# EAGLE design MODULO_LDR (EAGLE 7.5.0)
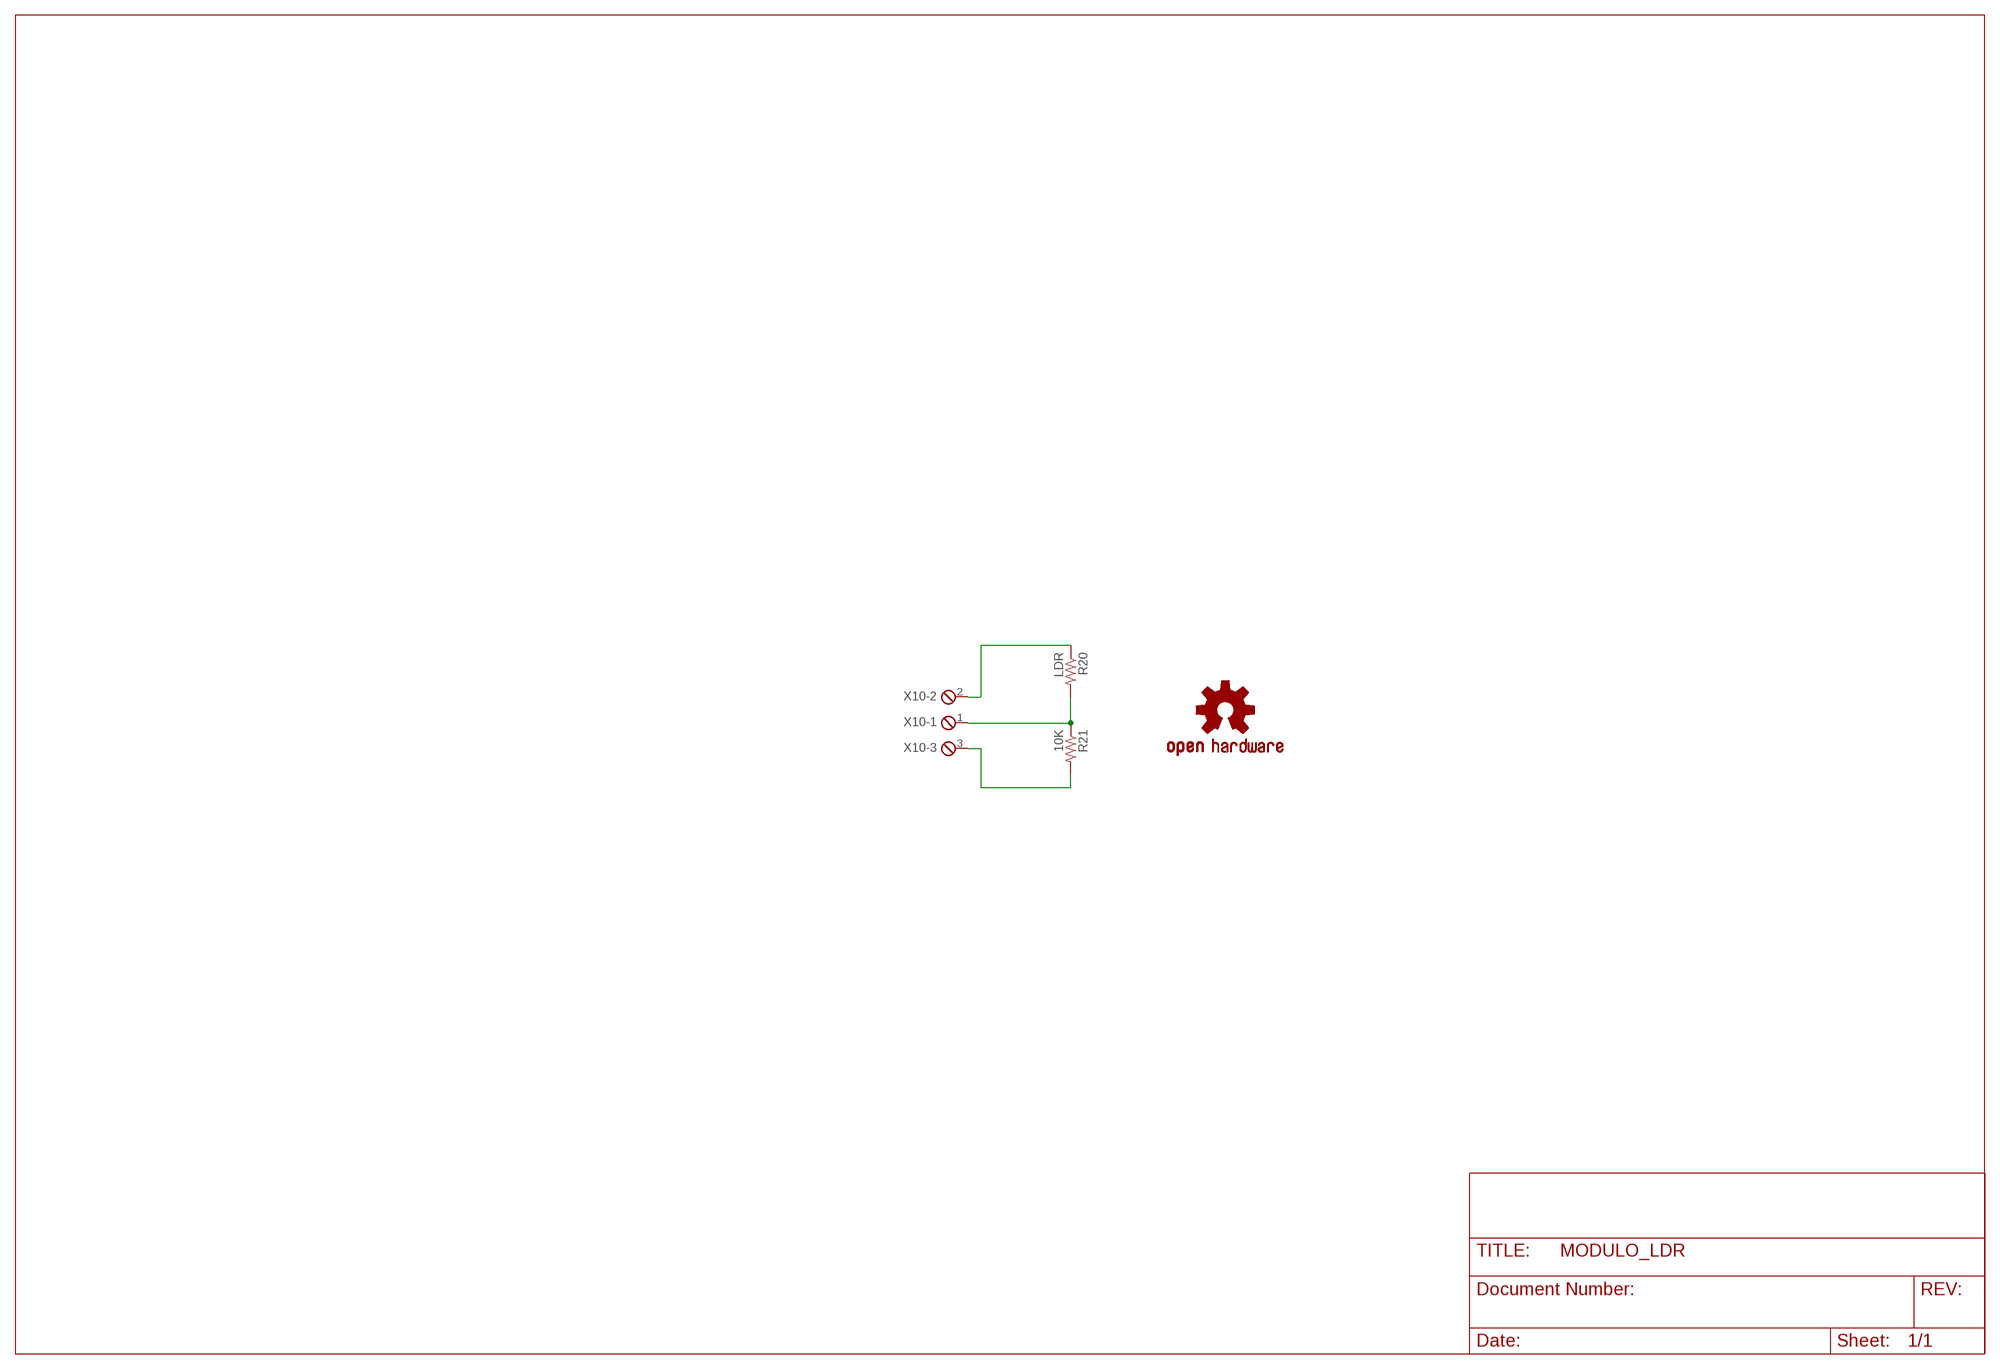
[diagram p0: schematic, sheet 1]

## Parts
LOGO1  OSHW-LOGOS  [OSHW-LOGO-S]
R20  LDR  RESISTORPTH-1/6W  [1/6W-RES]
R21  10K  RESISTORPTH-1/4W  [AXIAL-0.4]
X10  MPT3  [3POL254]

## Nets
N$51: R20.1 X10.2
N$52: R21.P$2 X10.3
N$53: R20.2 R21.P$1 X10.1

## Library data of the parts
LOGO1 = SparkFun-Aesthetics:OSHW-LOGO: Open Source Hardware Logo This logo indicates the piece of hardware it is found on incorporates a OSHW license and/or adheres to the definition of open source hardware found here: http://freedomdefined.org/OSHW
R20 R21 = SparkFun:RESISTOR: Resistor Basic schematic elements and footprints for 0603, 1206, and PTH resistors.
X10 = con-phoenix-254:MPT3: PHOENIX CONNECTOR; OC_FARNELL: unknown; OC_NEWARK: unknown

## Board
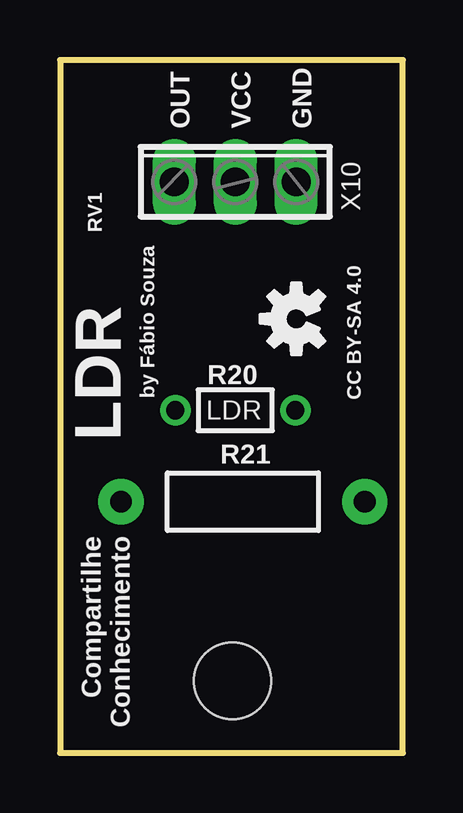
[diagram p1: board, top side]
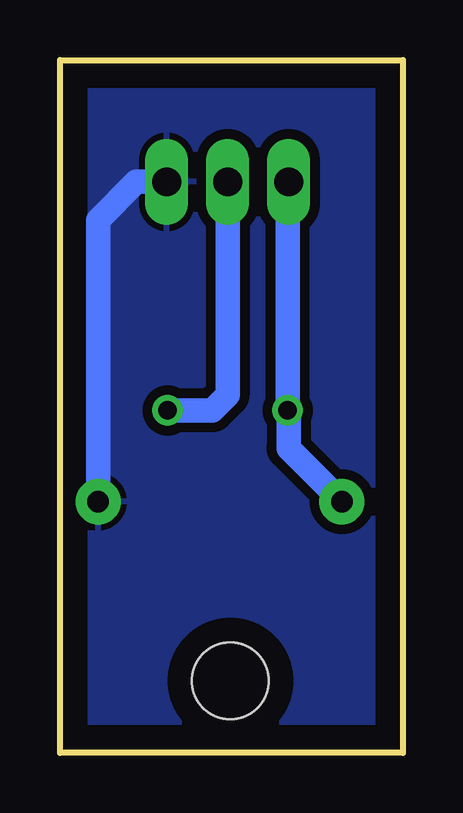
[diagram p2: board, bottom side, seen from below]

Size 14.29 x 28.89 mm. Coordinates in mm from the lower left corner, seen from the top.
Outline: 0,0 14.29,0 14.29,28.89 0,28.89 0,0
Copper layers (1*16): Top 0.035mm / dielectric 1.5mm / Bottom 0.035mm
Design rules "default": minimum track width 10mil, minimum drill 24mil, track to track 8mil, track to pad 8mil, pad to pad 8mil, via to via 8mil, smd to smd 8mil, copper to edge 40mil, drill to drill 8mil, minimum pad ring 10mil, minimum via ring 8mil, stop-mask expansion 4mil, vias tented up to drill 0mil, thermal gap 10mil
Holes 3.2 mm at 7.19,3.01

### Footprints (pad centres in the part's own frame; a part is rotated, then mirrored left to right if it is on the bottom)
1/6W-RES = drill 0.762: 1 -2.5,0; 2 2.5,0
AXIAL-0.4 = drill 0.9 pad 1.88: P$1 -5.08,0; P$2 5.08,0
3POL254 = drill 1.2 long: 1 -2.54,0; 2 0,0; 3 2.54,0

### Placement (x,y rotation side)
LOGO1  9.84,18.1 90 top
R20  7.3,14.29 180 top
R21  7.62,10.48 0 top
X10  7.3,23.81 0 top

### Tracks (layer width: path | path; a pad name or v marks a point on that pad's centre or on a via)
N$51
  Bottom 1.016: X10.2 7.3,14.92 7.94,14.29 R20.1
N$52
  Bottom 1.016: X10.3 11.11,23.81 12.7,22.23 12.7,12.38 R21.P$2
  pour Bottom (isolate 0.406): 0,28.89 14.29,28.89 14.29,0 0,0
N$53
  Bottom 1.016: X10.1 4.8,23.81 R20.2 4.76,14.29 4.76,12.7 R21.P$1

### Text on the board
tPlace: OUT | VCC | GND | RV1 | by Fábio Souza | CC BY-SA 4.0 | LDR | Compartilhe / Conhecimento